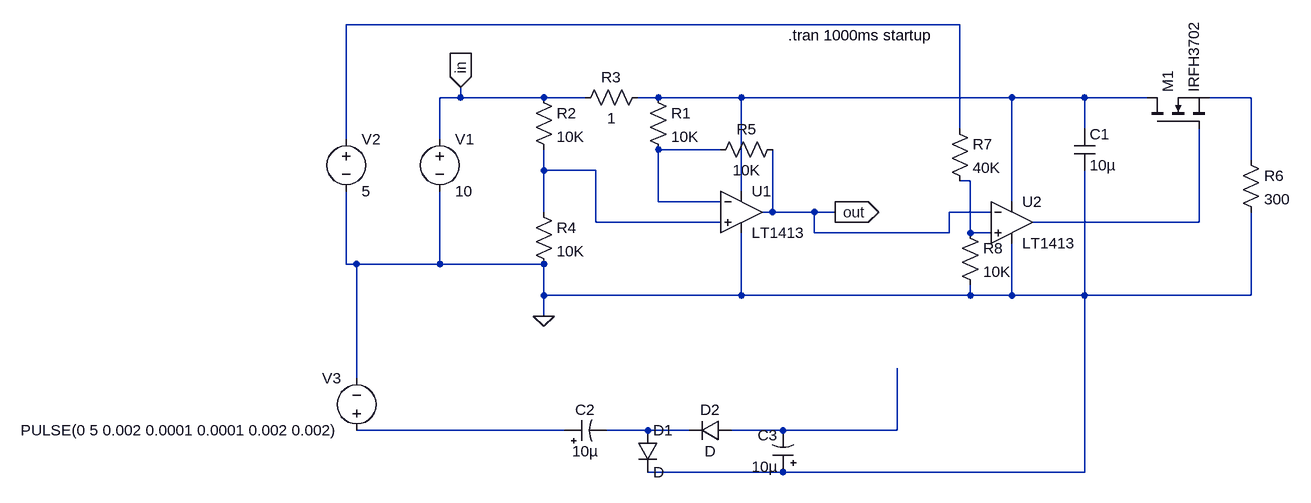
[diagram p0: schematic psu test.asc]
psu test.asc, the LTspice schematic file:
Version 4
SHEET 1 1348 688
WIRE 688 -16 -256 -16
WIRE -80 96 -80 80
WIRE -80 96 -112 96
WIRE 48 96 -80 96
WIRE 112 96 48 96
WIRE 224 96 192 96
WIRE 352 96 224 96
WIRE 768 96 352 96
WIRE 880 96 768 96
WIRE 976 96 880 96
WIRE 1136 96 1072 96
WIRE 688 144 688 -16
WIRE 880 144 880 96
WIRE -256 160 -256 -16
WIRE -112 160 -112 96
WIRE 320 176 224 176
WIRE 1136 192 1136 96
WIRE 48 208 48 176
WIRE 128 208 48 208
WIRE 704 224 688 224
WIRE 352 240 352 96
WIRE 224 256 224 176
WIRE 320 256 224 256
WIRE 768 256 768 96
WIRE 48 272 48 208
WIRE 400 272 400 176
WIRE 400 272 384 272
WIRE 464 272 400 272
WIRE 496 272 464 272
WIRE 736 272 672 272
WIRE 128 288 128 208
WIRE 320 288 128 288
WIRE 1056 288 1056 144
WIRE 1056 288 800 288
WIRE 464 304 464 272
WIRE 672 304 672 272
WIRE 672 304 464 304
WIRE 704 304 704 224
WIRE 736 304 704 304
WIRE -256 352 -256 240
WIRE -240 352 -256 352
WIRE -112 352 -112 240
WIRE -112 352 -240 352
WIRE 48 352 -112 352
WIRE 48 400 48 352
WIRE 352 400 352 304
WIRE 352 400 48 400
WIRE 704 400 704 384
WIRE 704 400 352 400
WIRE 768 400 768 320
WIRE 768 400 704 400
WIRE 880 400 880 208
WIRE 880 400 768 400
WIRE 1136 400 1136 272
WIRE 1136 400 880 400
WIRE 48 432 48 400
WIRE -240 528 -240 352
WIRE 80 608 -240 608
WIRE 208 608 144 608
WIRE 272 608 208 608
WIRE 416 608 336 608
WIRE 592 608 592 512
WIRE 592 608 416 608
WIRE 416 672 208 672
WIRE 880 672 880 400
WIRE 880 672 416 672
FLAG 48 432 0
FLAG 496 272 out
IOPIN 496 272 Out
FLAG -80 80 in
IOPIN -80 80 In
SYMBOL res 208 80 R0
SYMATTR InstName R1
SYMATTR Value 10K
SYMBOL res 32 80 R0
SYMATTR InstName R2
SYMATTR Value 10K
SYMBOL res 32 256 R0
SYMATTR InstName R4
SYMATTR Value 10K
SYMBOL res 416 160 R90
WINDOW 0 0 56 VBottom 2
WINDOW 3 32 56 VTop 2
SYMATTR InstName R5
SYMATTR Value 10K
SYMBOL voltage -112 144 R0
SYMATTR InstName V1
SYMATTR Value 10
SYMBOL res 208 80 R90
WINDOW 0 0 56 VBottom 2
WINDOW 3 32 56 VTop 2
SYMATTR InstName R3
SYMATTR Value 1
SYMBOL LT1413 352 208 R0
SYMATTR InstName U1
SYMBOL res 1120 176 R0
SYMATTR InstName R6
SYMATTR Value 300
SYMBOL LT1413 768 224 R0
SYMATTR InstName U2
SYMBOL res 672 128 R0
SYMATTR InstName R7
SYMATTR Value 40K
SYMBOL res 688 288 R0
SYMATTR InstName R8
SYMATTR Value 10K
SYMBOL cap 864 144 R0
SYMATTR InstName C1
SYMATTR Value 10µ
SYMBOL nmos 976 144 R270
SYMATTR InstName M1
SYMATTR Value IRFH3702
SYMBOL voltage -256 144 R0
SYMATTR InstName V2
SYMATTR Value 5
SYMBOL voltage -240 624 R180
WINDOW 0 24 96 Left 2
WINDOW 3 24 16 Left 2
SYMATTR InstName V3
SYMATTR Value PULSE(0 5 0.002 0.0001 0.0001 0.002 0.002)
SYMBOL polcap 80 624 R270
WINDOW 0 32 32 VTop 2
WINDOW 3 0 32 VBottom 2
SYMATTR InstName C2
SYMATTR Value 10µ
SYMBOL polcap 432 672 R180
WINDOW 0 24 57 Left 2
WINDOW 3 24 8 Left 2
SYMATTR InstName C3
SYMATTR Value 10µ
SYMBOL diode 192 608 R0
SYMATTR InstName D1
SYMBOL diode 336 592 R90
WINDOW 0 0 32 VBottom 2
WINDOW 3 32 32 VTop 2
SYMATTR InstName D2
TEXT 424 0 Left 2 !.tran 1000ms startup

The netlist it stands for:
* psu test.asc
R1 N002 N004 10K
R2 in N005 10K
R4 N005 0 10K
R5 out N004 10K
V1 in 0 10
R3 N002 in 1
XU1 N005 N004 N002 0 out LT1413  ; pins In+ In- V+ V- OUT
R6 N003 0 300
XU2 N006 out N002 0 N007 LT1413  ; pins In+ In- V+ V- OUT
R7 N001 N006 40K
R8 N006 0 10K
C1 N002 0 10µ
M1 N002 N007 N003 N003 IRFH3702
V2 N001 0 5
V3 N008 0 PULSE(0 5 0.002 0.0001 0.0001 0.002 0.002)
C2 N008 N009 10µ
C3 0 N010 10µ
D1 N009 0 D
D2 N010 N009 D
.model D D
.lib standard.dio
.model NMOS NMOS
.model PMOS PMOS
.lib standard.mos
.tran 1000ms startup
.lib LTC.lib
.backanno
.end